# EAGLE schematic board2corrected (EAGLE 6.6.0)

## Sheet 1 of 4
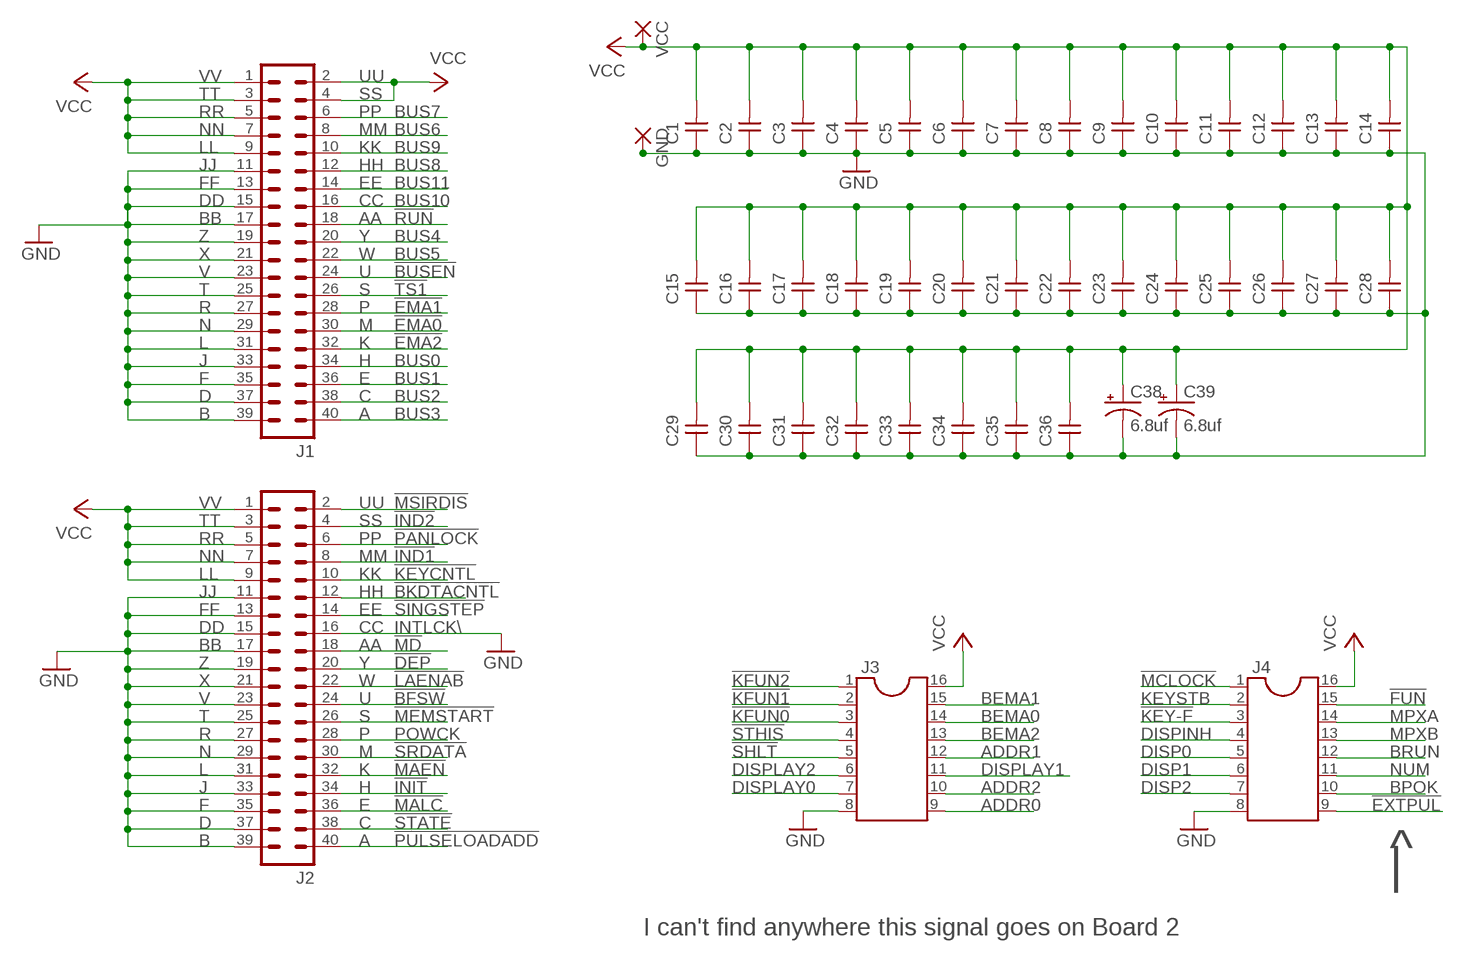
[diagram p0: schematic, sheet 1]

### Parts
C1  CAPNP-5  [C-5]
C2  CAPNP-5  [C-5]
C3  CAPNP-5  [C-5]
C4  CAPNP-5  [C-5]
C5  CAPNP-5  [C-5]
C6  CAPNP-5  [C-5]
C7  CAPNP-5  [C-5]
C8  CAPNP-5  [C-5]
C9  CAPNP-5  [C-5]
C10  CAPNP-5  [C-5]
C11  CAPNP-5  [C-5]
C12  CAPNP-5  [C-5]
C13  CAPNP-5  [C-5]
C14  CAPNP-5  [C-5]
C15  CAPNP-5  [C-5]
C16  CAPNP-5  [C-5]
C17  CAPNP-5  [C-5]
C18  CAPNP-5  [C-5]
C19  CAPNP-5  [C-5]
C20  CAPNP-5  [C-5]
C21  CAPNP-5  [C-5]
C22  CAPNP-5  [C-5]
C23  CAPNP-5  [C-5]
C24  CAPNP-5  [C-5]
C25  CAPNP-5  [C-5]
C26  CAPNP-5  [C-5]
C27  CAPNP-5  [C-5]
C28  CAPNP-5  [C-5]
C29  CAPNP-5  [C-5]
C30  CAPNP-5  [C-5]
C31  CAPNP-5  [C-5]
C32  CAPNP-5  [C-5]
C33  CAPNP-5  [C-5]
C34  CAPNP-5  [C-5]
C35  CAPNP-5  [C-5]
C36  CAPNP-5  [C-5]
C38  6.8uf  CPOL-USE15-5AXIAL  [E15-5]
C39  6.8uf  CPOL-USE15-5AXIAL  [E15-5]
GND  3,81/1,4  [3,81/1,4]
J1  40H  [40H]
J2  40H  [40H]
J3  DIL16S  [SOCKET-16]
J4  DIL16S  [SOCKET-16]
VCC  3,81/1,4  [3,81/1,4]

### Nets
!BFSW: J2.24 ; also sheet 4
!BKDTACNTL: J2.12 ; also sheet 4
!BUSEN: J1.24 ; also sheet 4
!DEP: J2.20 ; also sheet 4
!EMA0: J1.30 ; also sheet 4
!EMA1: J1.28 ; also sheet 4
!EMA2: J1.32 ; also sheet 4
!EXTPUL: J4.9
!FUN: J4.15 ; also sheet 3,4
!IND1: J2.8 ; also sheet 4
!IND2: J2.4 ; also sheet 4
!INIT: J2.34 ; also sheet 4
!KEY-F: J4.3 ; also sheet 4
!KEYCNTL: J2.10 ; also sheet 4
!KFUN0: J3.3 ; also sheet 2,4
!KFUN1: J3.2 ; also sheet 2,4
!KFUN2: J3.1 ; also sheet 2,4
!LAENAB: J2.22 ; also sheet 4
!MAEN: J2.32 ; also sheet 4
!MALC: J2.36 ; also sheet 4
!MCLOCK: J4.1 ; also sheet 3
!MD: J2.18 ; also sheet 4
!MEMSTART: J2.26 ; also sheet 4
!MSIRDIS: J2.2 ; also sheet 4
!PANLOCK: J2.6 ; also sheet 4
!PULSELOADADD: J2.40 ; also sheet 4
!RUN: J1.18 ; also sheet 3
!SHLT: J3.5 ; also sheet 4
!SINGSTEP: J2.14 ; also sheet 4
!SRDATA: J2.30 ; also sheet 3,4
!STATE: J2.38 ; also sheet 4
!STHIS: J3.4 ; also sheet 4
!TS1: J1.26 ; also sheet 3,4
ADDR0: J3.9 ; also sheet 2
ADDR1: J3.12 ; also sheet 2
ADDR2: J3.10 ; also sheet 2
BEMA0: J3.14 ; also sheet 4
BEMA1: J3.15 ; also sheet 4
BEMA2: J3.13 ; also sheet 4
BPOK: J4.10 ; also sheet 2,3,4
BRUN: J4.12 ; also sheet 3,4
BUS0: J1.34 ; also sheet 2
BUS1: J1.36 ; also sheet 2
BUS2: J1.38 ; also sheet 2
BUS3: J1.40 ; also sheet 2
BUS4: J1.20 ; also sheet 2
BUS5: J1.22 ; also sheet 2
BUS6: J1.8 ; also sheet 2
BUS7: J1.6 ; also sheet 2
BUS8: J1.12 ; also sheet 2
BUS9: J1.10 ; also sheet 2
BUS10: J1.16 ; also sheet 2
BUS11: J1.14 ; also sheet 2
DISP0: J4.5 ; also sheet 4
DISP1: J4.6 ; also sheet 4
DISP2: J4.7 ; also sheet 4
DISPINH: J4.4 ; also sheet 3,4
DISPLAY0: J3.7 ; also sheet 2
DISPLAY1: J3.11 ; also sheet 2
DISPLAY2: J3.6 ; also sheet 2
GND [Supply]: C1.1 C2.1 C3.1 C4.1 C5.1 C6.1 C7.1 C8.1 C9.1 C10.1 C11.1 C12.1 C13.1 C14.1 C15.1 C16.1 C17.1 C18.1 C19.1 C20.1 C21.1 C22.1 C23.1 C24.1 C25.1 C26.1 C27.1 C28.1 C29.1 C30.1 C31.1 C32.1 C33.1 C34.1 C35.1 C36.1 C38.- C39.- GND.1(P) J1.11 J1.13 J1.15 J1.17 J1.19 J1.21 J1.23 J1.25 J1.27 J1.29 J1.31 J1.33 J1.35 J1.37 J1.39 J2.11 J2.13 J2.15 J2.16 J2.17 J2.19 J2.21 J2.23 J2.25 J2.27 J2.29 J2.31 J2.33 J2.35 J2.37 J2.39 J3.8 J4.8 ; also sheet 2,3
KEYSTB: J4.2 ; also sheet 3
MPXA: J4.14 ; also sheet 2
MPXB: J4.13 ; also sheet 2
NUM: J4.11 ; also sheet 3
POWCK: J2.28 ; also sheet 4
VCC [Supply]: C1.2 C2.2 C3.2 C4.2 C5.2 C6.2 C7.2 C8.2 C9.2 C10.2 C11.2 C12.2 C13.2 C14.2 C15.2 C16.2 C17.2 C18.2 C19.2 C20.2 C21.2 C22.2 C23.2 C24.2 C25.2 C26.2 C27.2 C28.2 C29.2 C30.2 C31.2 C32.2 C33.2 C34.2 C35.2 C36.2 C38.+ C39.+ J1.1 J1.2 J1.3 J1.4 J1.5 J1.7 J1.9 J2.1 J2.3 J2.5 J2.7 J2.9 J3.16 J4.16 VCC.1(P) ; also sheet 2,3,4

### Notes on the sheet
- VV | UU
- TT | SS
- RR | PP
- NN | MM
- LL | KK
- JJ | HH
- FF | EE
- DD | CC
- BB | AA
- Z | Y
- X | W
- V | U
- T | S
- R | P
- N | M
- L | K
- J | H
- F | E
- D | C
- B | A
- VV | UU
- TT | SS
- RR | PP
- NN | MM
- LL | KK
- JJ | HH
- FF | EE
- DD | CC | INTLCK\\
- BB | AA
- Z | Y
- X | W
- V | U
- T | S
- R | P
- N | M
- L | K
- J | H
- F | E
- D | C
- B | A
- ^
- |
- I can't find anywhere this signal goes on Board 2

## Sheet 2 of 4
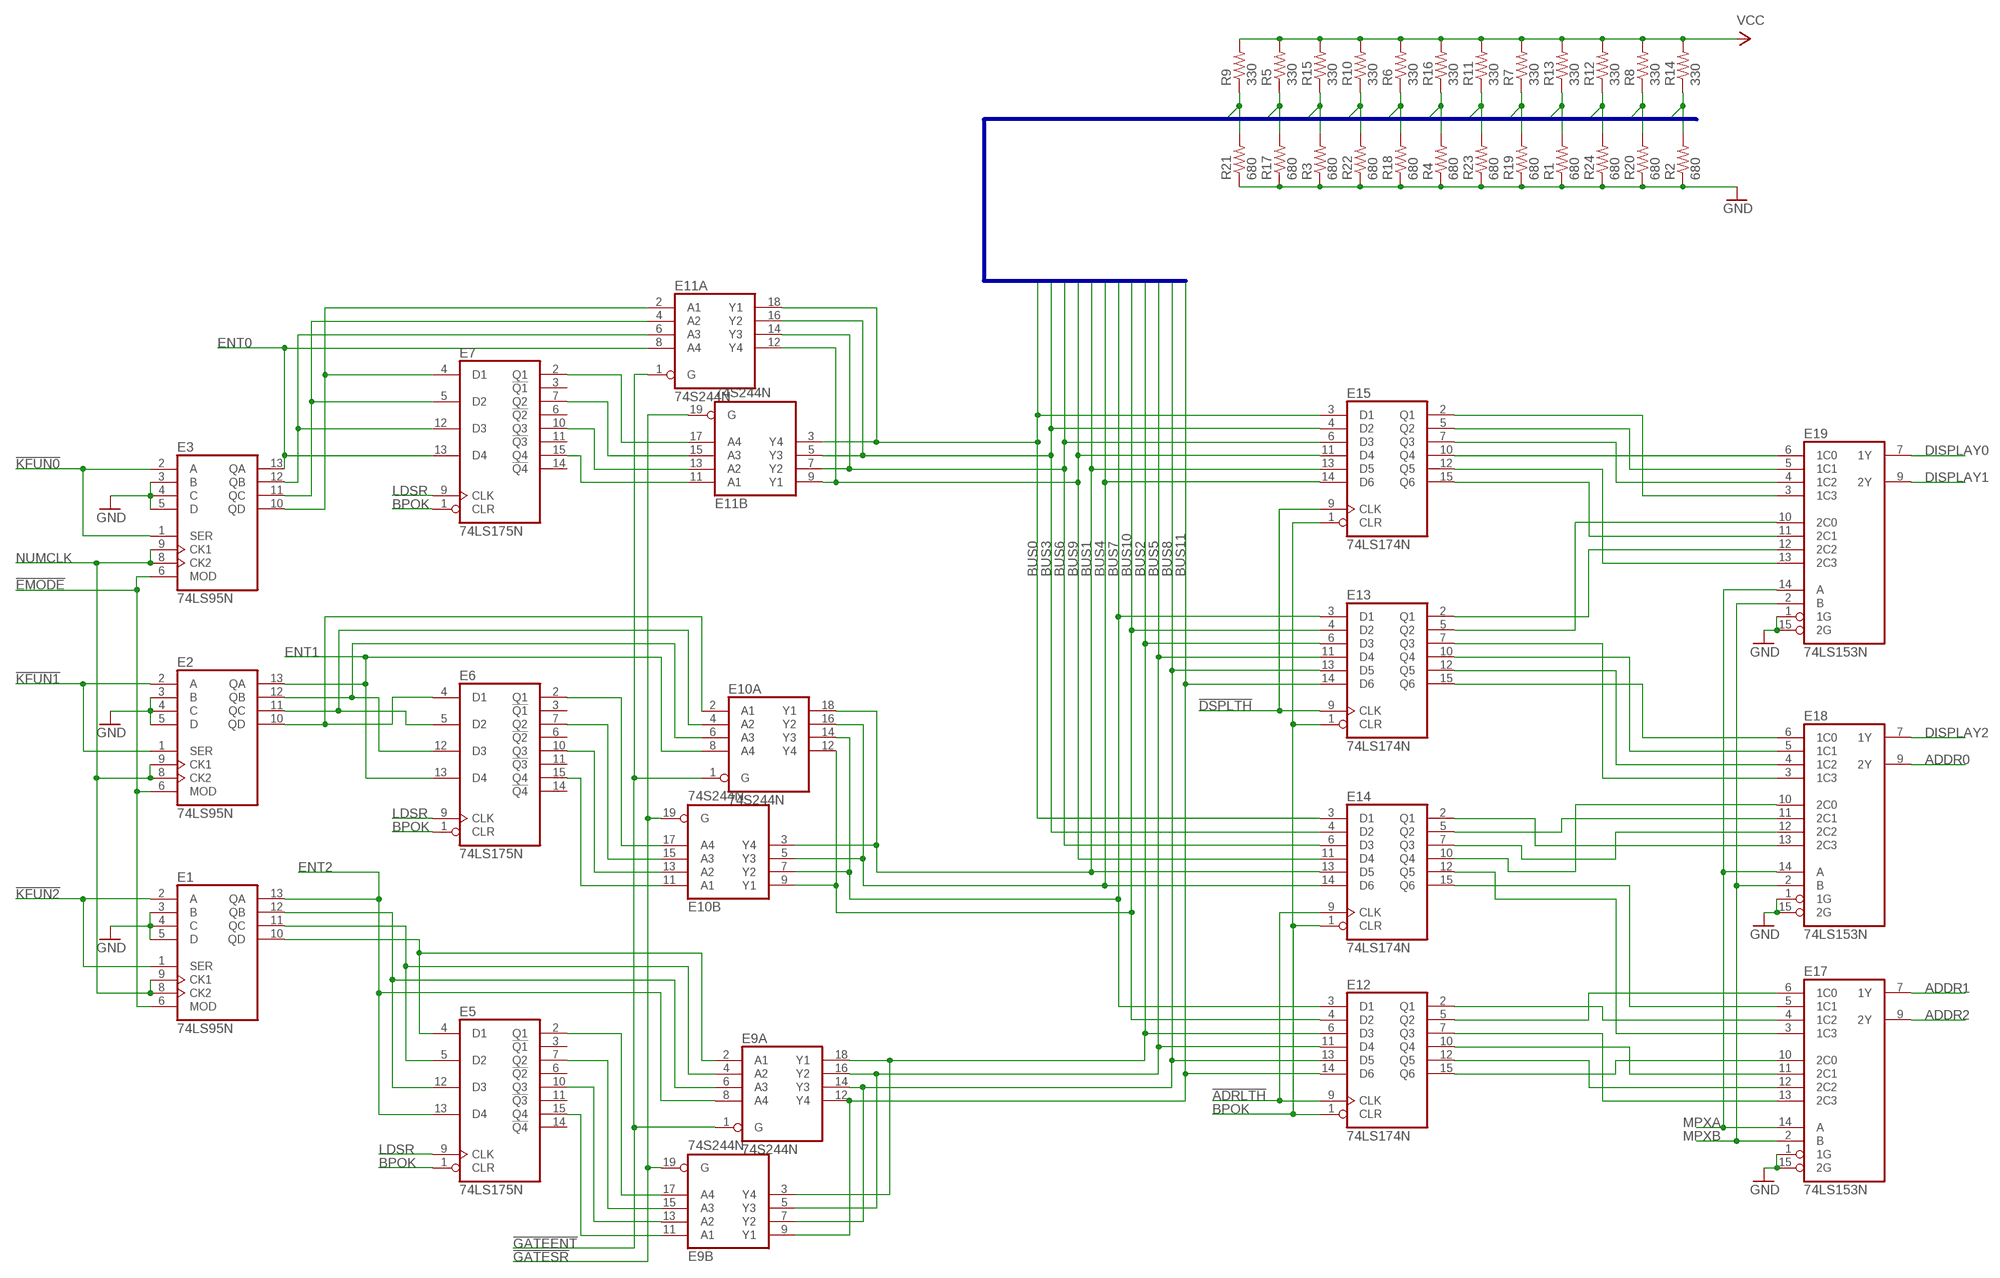
[diagram p1: schematic, sheet 2]

### Parts
E1  74LS95N  [DIL14]
E2  74LS95N  [DIL14]
E3  74LS95N  [DIL14]
E5  74LS175N  [DIL16]
E6  74LS175N  [DIL16]
E7  74LS175N  [DIL16]
E9  74S244N  [DIL20]
E10  74S244N  [DIL20]
E11  74S244N  [DIL20]
E12  74LS174N  [DIL16]
E13  74LS174N  [DIL16]
E14  74LS174N  [DIL16]
E15  74LS174N  [DIL16]
E17  74LS153N  [DIL16]
E18  74LS153N  [DIL16]
E19  74LS153N  [DIL16]
R1  680  R-US_0207/10  [0207/10]
R2  680  R-US_0207/10  [0207/10]
R3  680  R-US_0207/10  [0207/10]
R4  680  R-US_0207/10  [0207/10]
R5  330  R-US_0207/10  [0207/10]
R6  330  R-US_0207/10  [0207/10]
R7  330  R-US_0207/10  [0207/10]
R8  330  R-US_0207/10  [0207/10]
R9  330  R-US_0207/10  [0207/10]
R10  330  R-US_0207/10  [0207/10]
R11  330  R-US_0207/10  [0207/10]
R12  330  R-US_0207/10  [0207/10]
R13  330  R-US_0207/10  [0207/10]
R14  330  R-US_0207/10  [0207/10]
R15  330  R-US_0207/10  [0207/10]
R16  330  R-US_0207/10  [0207/10]
R17  680  R-US_0207/10  [0207/10]
R18  680  R-US_0207/10  [0207/10]
R19  680  R-US_0207/10  [0207/10]
R20  680  R-US_0207/10  [0207/10]
R21  680  R-US_0207/10  [0207/10]
R22  680  R-US_0207/10  [0207/10]
R23  680  R-US_0207/10  [0207/10]
R24  680  R-US_0207/10  [0207/10]

### Nets
!ADRLTH: E12.9(CLK) E14.9(CLK) ; also sheet 3
!DSPLTH: E13.9(CLK) E15.9(CLK) ; also sheet 3
!EMODE: E1.6(MOD) E2.6(MOD) E3.6(MOD) ; also sheet 3
!GATEENT: E9.1(A:G) E10.1(A:G) E11.1(A:G) ; also sheet 3,4
!GATESR: E9.19(B:G) E10.19(B:G) E11.19(B:G) ; also sheet 4
!KFUN0: E3.1(SER) E3.2(A) ; also sheet 1,4
!KFUN1: E2.1(SER) E2.2(A) ; also sheet 1,4
!KFUN2: E1.1(SER) E1.2(A) ; also sheet 1,4
ADDR0: E18.9(2Y) ; also sheet 1
ADDR1: E17.7(1Y) ; also sheet 1
ADDR2: E17.9(2Y) ; also sheet 1
BPOK: E5.1(CLR) E6.1(CLR) E7.1(CLR) E12.1(CLR) E13.1(CLR) E14.1(CLR) E15.1(CLR) ; also sheet 1,3,4
BUS0: E11.3(B:Y4) E11.18(A:Y1) E14.3(D1) E15.3(D1) R9.1 R21.2 ; also sheet 1
BUS1: E10.3(B:Y4) E10.18(A:Y1) E14.13(D5) E15.13(D5) R5.1 R17.2 ; also sheet 1
BUS2: E9.3(B:Y4) E9.18(A:Y1) E12.6(D3) E13.6(D3) R3.2 R15.1 ; also sheet 1
BUS3: E11.5(B:Y3) E11.16(A:Y2) E14.4(D2) E15.4(D2) R10.1 R22.2 ; also sheet 1
BUS4: E10.5(B:Y3) E10.16(A:Y2) E14.14(D6) E15.14(D6) R6.1 R18.2 ; also sheet 1
BUS5: E9.5(B:Y3) E9.16(A:Y2) E12.11(D4) E13.11(D4) R4.2 R16.1 ; also sheet 1
BUS6: E11.7(B:Y2) E11.14(A:Y3) E14.6(D3) E15.6(D3) R11.1 R23.2 ; also sheet 1
BUS7: E10.7(B:Y2) E10.14(A:Y3) E12.3(D1) E13.3(D1) R7.1 R19.2 ; also sheet 1
BUS8: E9.7(B:Y2) E9.14(A:Y3) E12.13(D5) E13.13(D5) R1.2 R12.1 R13.1 R24.2 ; also sheet 1
BUS9: E11.9(B:Y1) E11.12(A:Y4) E14.11(D4) E15.11(D4) ; also sheet 1
BUS10: E10.9(B:Y1) E10.12(A:Y4) E12.4(D2) E13.4(D2) R8.1 R20.2 ; also sheet 1
BUS11: E9.9(B:Y1) E9.12(A:Y4) E12.14(D6) E13.14(D6) R2.2 R14.1 ; also sheet 1
DISPLAY0: E19.7(1Y) ; also sheet 1
DISPLAY1: E19.9(2Y) ; also sheet 1
DISPLAY2: E18.7(1Y) ; also sheet 1
ENT0: E3.13(QA) E7.13(D4) E11.8(A:A4) ; also sheet 4
ENT1: E2.13(QA) E6.13(D4) E10.8(A:A4) ; also sheet 4
ENT2: E1.13(QA) E5.13(D4) E9.8(A:A4) ; also sheet 4
GND [Supply]: E1.3(B) E1.4(C) E1.5(D) E2.3(B) E2.4(C) E2.5(D) E3.3(B) E3.4(C) E3.5(D) E17.1(1G) E17.15(2G) E18.1(1G) E18.15(2G) E19.1(1G) E19.15(2G) R1.1 R2.1 R3.1 R4.1 R17.1 R18.1 R19.1 R20.1 R21.1 R22.1 R23.1 R24.1 ; also sheet 1,3
LDSR: E5.9(CLK) E6.9(CLK) E7.9(CLK) ; also sheet 4
MPXA: E17.14(A) E18.14(A) E19.14(A) ; also sheet 1
MPXB: E17.2(B) E18.2(B) E19.2(B) ; also sheet 1
N$1: E2.12(QB) E6.12(D3) E10.6(A:A3)
N$2: E1.12(QB) E5.12(D3) E9.6(A:A3)
N$3: E1.10(QD) E5.4(D1) E9.2(A:A1)
N$4: E1.11(QC) E5.5(D2) E9.4(A:A2)
N$5: E2.10(QD) E6.4(D1) E10.2(A:A1)
N$6: E2.11(QC) E6.5(D2) E10.4(A:A2)
N$7: E3.12(QB) E7.12(D3) E11.6(A:A3)
N$8: E3.10(QD) E7.4(D1) E11.2(A:A1)
N$9: E3.11(QC) E7.5(D2) E11.4(A:A2)
N$10: E15.2(Q1) E19.3(1C3)
N$11: E15.5(Q2) E19.5(1C1)
N$12: E15.7(Q3) E19.4(1C2)
N$13: E15.10(Q4) E19.6(1C0)
N$14: E15.12(Q5) E19.13(2C3)
N$15: E15.15(Q6) E19.11(2C1)
N$16: E13.2(Q1) E19.12(2C2)
N$17: E13.5(Q2) E19.10(2C0)
N$18: E13.7(Q3) E18.3(1C3)
N$19: E13.10(Q4) E18.5(1C1)
N$20: E13.12(Q5) E18.4(1C2)
N$21: E13.15(Q6) E18.6(1C0)
N$22: E14.2(Q1) E18.13(2C3)
N$23: E14.5(Q2) E18.11(2C1)
N$24: E14.7(Q3) E18.12(2C2)
N$25: E14.10(Q4) E18.10(2C0)
N$26: E12.15(Q6) E17.10(2C0)
N$27: E12.12(Q5) E17.12(2C2)
N$28: E12.10(Q4) E17.11(2C1)
N$29: E12.7(Q3) E17.13(2C3)
N$30: E14.15(Q6) E17.5(1C1)
N$31: E14.12(Q5) E17.3(1C3)
N$32: E12.2(Q1) E17.4(1C2)
N$33: E12.5(Q2) E17.6(1C0)
N$63: E7.15(Q4) E11.11(B:A1)
N$64: E7.10(Q3) E11.13(B:A2)
N$65: E7.7(Q2) E11.15(B:A3)
N$66: E7.2(Q1) E11.17(B:A4)
N$79: E6.15(Q4) E10.11(B:A1)
N$80: E6.10(Q3) E10.13(B:A2)
N$81: E6.7(Q2) E10.15(B:A3)
N$82: E6.2(Q1) E10.17(B:A4)
N$83: E5.15(Q4) E9.11(B:A1)
N$84: E5.10(Q3) E9.13(B:A2)
N$85: E5.2(Q1) E9.17(B:A4)
N$86: E5.7(Q2) E9.15(B:A3)
NUMCLK: E1.8(CK2) E1.9(CK1) E2.8(CK2) E2.9(CK1) E3.8(CK2) E3.9(CK1) ; also sheet 3
VCC [Supply]: R5.2 R6.2 R7.2 R8.2 R9.2 R10.2 R11.2 R12.2 R13.2 R14.2 R15.2 R16.2 ; also sheet 1,3,4
Unconnected: E5.3(!Q1) E5.6(!Q2) E5.11(!Q3) E5.14(!Q4) E6.3(!Q1) E6.6(!Q2) E6.11(!Q3) E6.14(!Q4) E7.3(!Q1) E7.6(!Q2) E7.11(!Q3) E7.14(!Q4)

### Buses
BUS[0..11]

## Sheet 3 of 4
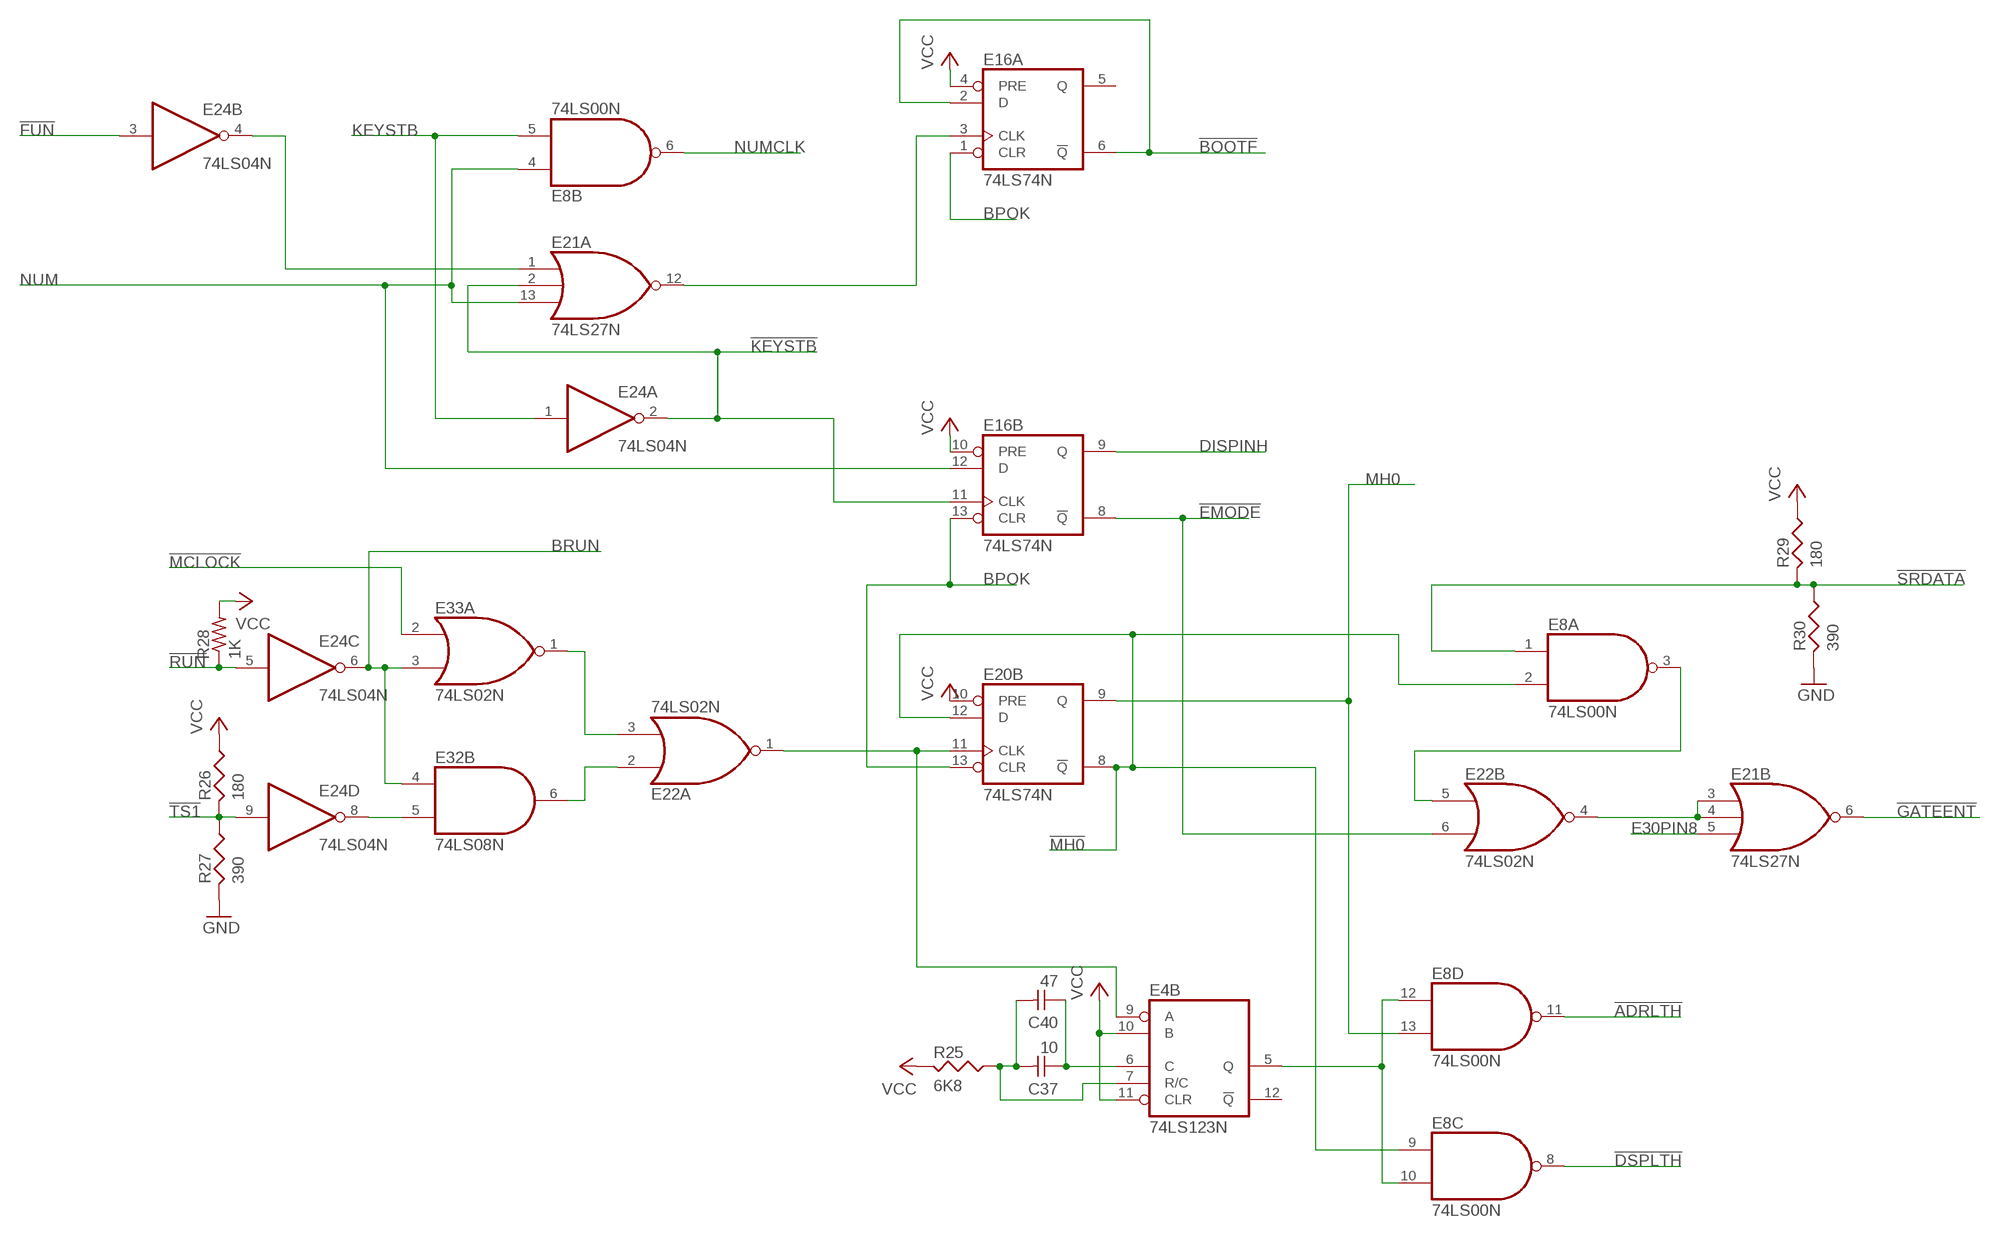
[diagram p2: schematic, sheet 3]

### Parts
C37  10  CAPNP-5  [C-5]
C40  47  CAPNP-5  [C-5]
E4  74LS123N  [DIL16]
E8  74LS00N  [DIL14]
E16  74LS74N  [DIL14]
E20  74LS74N  [DIL14]
E21  74LS27N  [DIL14]
E22  74LS02N  [DIL14]
E24  74LS04N  [DIL14]
E32  74LS08N  [DIL14]
E33  74LS02N  [DIL14]
R25  6K8  RESUS-10  [R-10]
R26  180  RESUS-10  [R-10]
R27  390  RESUS-10  [R-10]
R28  1K  R-US_0207/10  [0207/10]
R29  180  RESUS-10  [R-10]
R30  390  RESUS-10  [R-10]

### Nets
!ADRLTH: E8.11(D:O) ; also sheet 2
!BOOTF: E16.2(A:D) E16.6(A:!Q) ; also sheet 4
!DSPLTH: E8.8(C:O) ; also sheet 2
!EMODE: E16.8(B:!Q) E22.6(B:I1) ; also sheet 2
!FUN: E24.3(B:I) ; also sheet 1,4
!GATEENT: E21.6(B:O) ; also sheet 2,4
!KEYSTB: E16.11(B:CLK) E21.2(A:I1) E24.2(A:O) ; also sheet 4
!MCLOCK: E33.2(A:I0) ; also sheet 1
!MH0: E8.2(A:I1) E8.9(C:I0) E20.8(B:!Q) E20.12(B:D) ; also sheet 4
!RUN: E24.5(C:I) R28.1 ; also sheet 1
!SRDATA: E8.1(A:I0) R29.2 R30.1 ; also sheet 1,4
!TS1: E24.9(D:I) R26.2 R27.1 ; also sheet 1,4
BPOK: E16.1(A:CLR) E16.13(B:CLR) E20.13(B:CLR) ; also sheet 1,2,4
BRUN: E24.6(C:O) E32.4(B:I0) E33.3(A:I1) ; also sheet 1,4
DISPINH: E16.9(B:Q) ; also sheet 1,4
E30PIN8: E21.5(B:I2) ; also sheet 4
GND [Supply]: R27.2 R30.2 ; also sheet 1,2
KEYSTB: E8.5(B:I1) E24.1(A:I) ; also sheet 1
MH0: E8.13(D:I1) E20.9(B:Q) ; also sheet 4
N$34: E16.3(A:CLK) E21.12(A:O)
N$35: E21.1(A:I0) E24.4(B:O)
N$38: E8.3(A:O) E22.5(B:I0)
N$39: E22.3(A:I1) E33.1(A:O)
N$40: E22.2(A:I0) E32.6(B:O)
N$41: E4.9(B:A) E20.11(B:CLK) E22.1(A:O)
N$44: E24.8(D:O) E32.5(B:I1)
N$52: E21.3(B:I0) E21.4(B:I1) E22.4(B:O)
N$75: E4.5(B:Q) E8.10(C:I1) E8.12(D:I0)
N$88: C37.1 C40.1 E4.6(B:C)
N$89: C37.2 C40.2 E4.7(B:R/C) R25.1
NUM: E8.4(B:I0) E16.12(B:D) E21.13(A:I2) ; also sheet 1
NUMCLK: E8.6(B:O) ; also sheet 2
VCC [Supply]: E4.10(B:B) E4.11(B:CLR) E16.4(A:PRE) E16.10(B:PRE) E20.10(B:PRE) R25.2 R26.1 R28.2 R29.1 ; also sheet 1,2,4
Unconnected: E4.1(A:A) E4.2(A:B) E4.3(A:CLR) E4.4(A:!Q) E4.12(B:!Q) E4.13(A:Q) E4.14(A:C) E4.15(A:R/C) E16.5(A:Q)

## Sheet 4 of 4
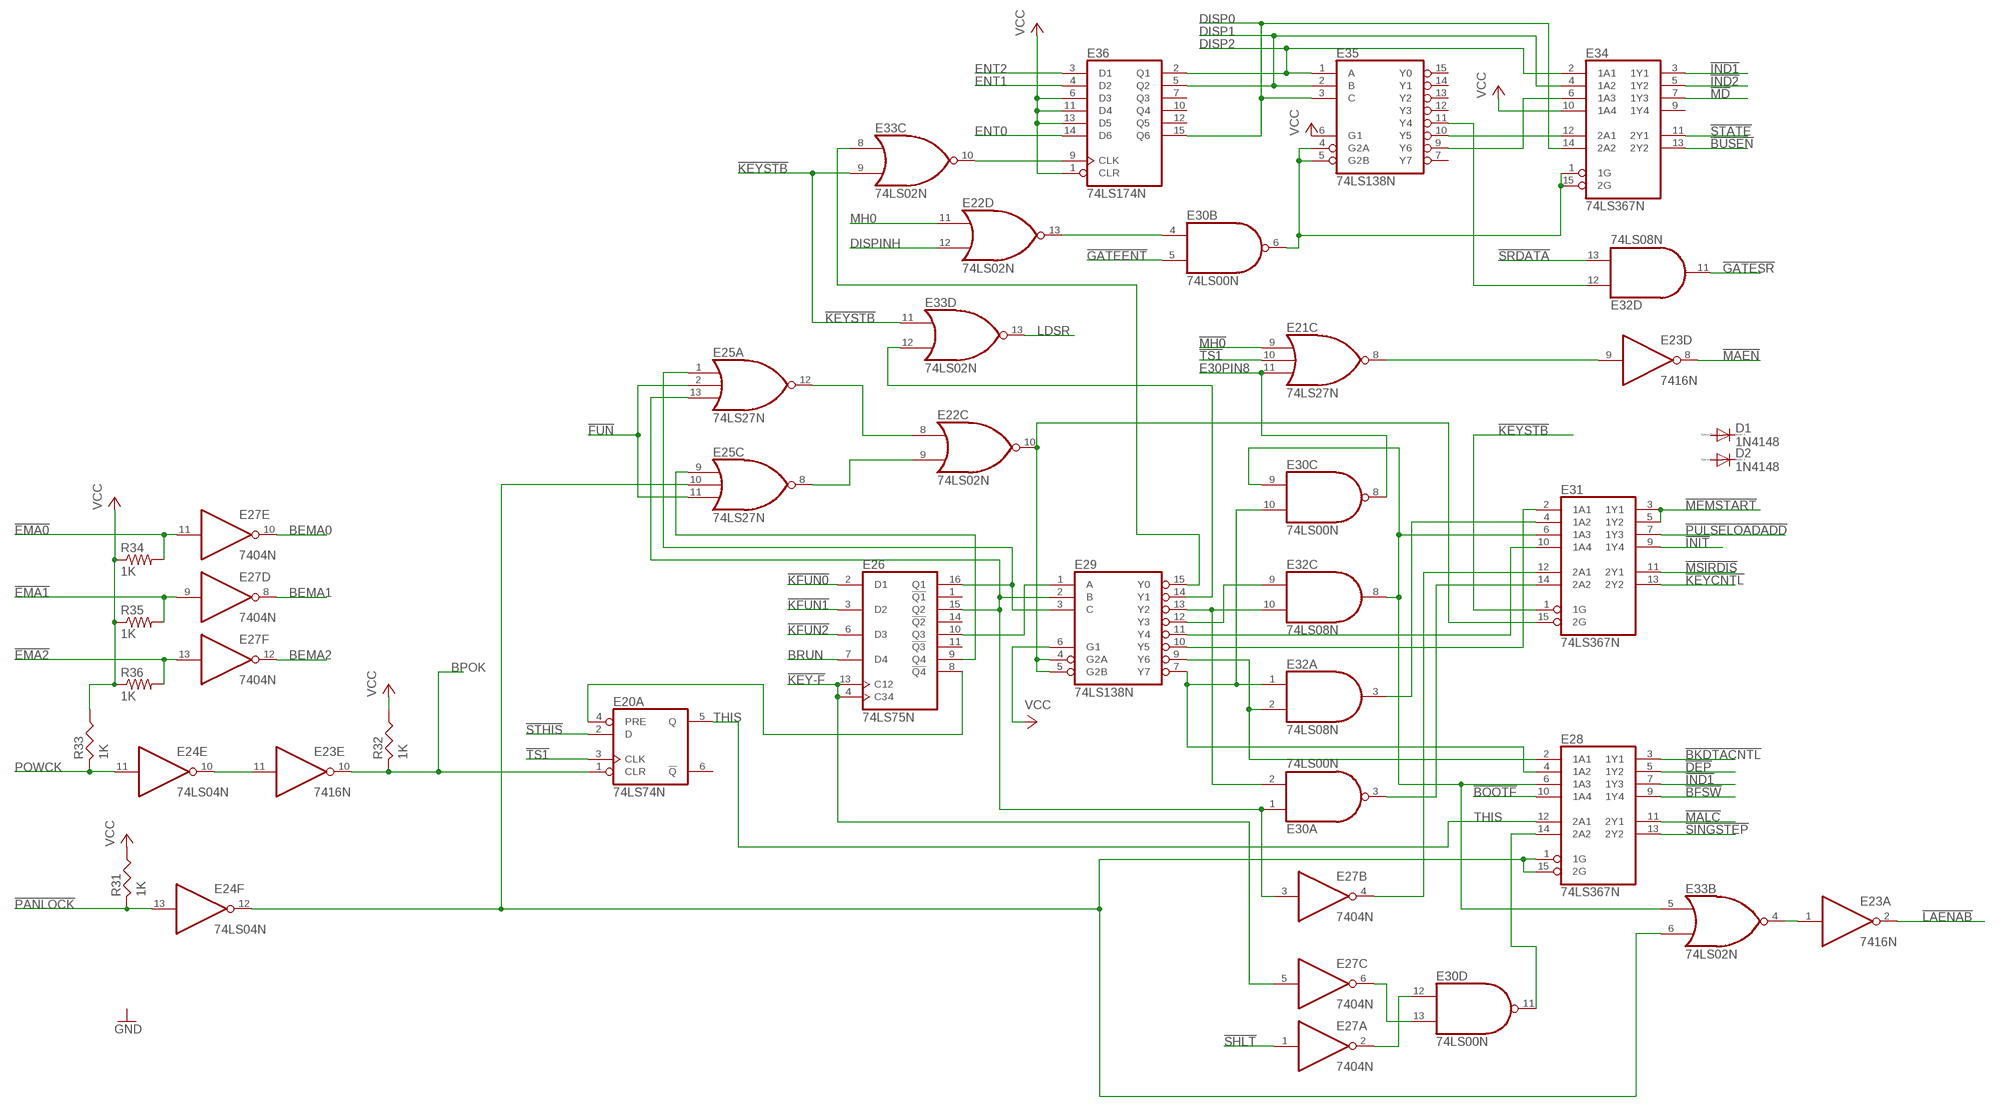
[diagram p3: schematic, sheet 4]

### Parts
D1  1N4148  1N4148DO35-10  [DO35-10]
D2  1N4148  1N4148DO35-10  [DO35-10]
E23  7416N  [DIL14]
E25  74LS27N  [DIL14]
E26  74LS75N  [DIL16]
E27  7404N  [DIL14]
E28  74LS367N  74367N  [DIL16]
E29  74LS138N  [DIL16]
E30  74LS00N  [DIL14]
E31  74LS367N  74367N  [DIL16]
E34  74LS367N  74367N  [DIL16]
E35  74LS138N  [DIL16]
E36  74LS174N  [DIL16]
R31  1K  RESUS-10  [R-10]
R32  1K  RESUS-10  [R-10]
R33  1K  RESUS-10  [R-10]
R34  1K  R-US_0207/10  [0207/10]
R35  1K  R-US_0207/10  [0207/10]
R36  1K  R-US_0207/10  [0207/10]

### Nets
!BFSW: E28.9(1Y4) ; also sheet 1
!BKDTACNTL: E28.3(1Y1) ; also sheet 1
!BOOTF: E28.10(1A4) ; also sheet 3
!BUSEN: E34.13(2Y2) ; also sheet 1
!DEP: E28.5(1Y2) ; also sheet 1
!EMA0: E27.11(E:I) R34.2 ; also sheet 1
!EMA1: E27.9(D:I) R35.2 ; also sheet 1
!EMA2: E27.13(F:I) R36.2 ; also sheet 1
!FUN: E25.2(A:I1) E25.11(C:I2) ; also sheet 1,3
!GATEENT: E30.5(B:I1) ; also sheet 2,3
!GATESR: E32.11(D:O) ; also sheet 2
!IND1: E28.7(1Y3) E34.3(1Y1) ; also sheet 1
!IND2: E34.5(1Y2) ; also sheet 1
!INIT: E31.9(1Y4) ; also sheet 1
!KEY-F: E26.4(C34) E26.13(C12) E27.5(C:I) ; also sheet 1
!KEYCNTL: E31.13(2Y2) ; also sheet 1
!KEYSTB: E31.1(1G) E33.9(C:I1) E33.11(D:I0) ; also sheet 3
!KFUN0: E26.2(D1) ; also sheet 1,2
!KFUN1: E26.3(D2) ; also sheet 1,2
!KFUN2: E26.6(D3) ; also sheet 1,2
!LAENAB: E23.2(A:O) ; also sheet 1
!MAEN: E23.8(D:O) ; also sheet 1
!MALC: E28.11(2Y1) ; also sheet 1
!MD: E34.7(1Y3) ; also sheet 1
!MEMSTART: E31.3(1Y1) E31.5(1Y2) ; also sheet 1
!MH0: E21.9(C:I0) ; also sheet 3
!MSIRDIS: E31.11(2Y1) ; also sheet 1
!PANLOCK: E24.13(F:I) R31.2 ; also sheet 1
!PULSELOADADD: E31.7(1Y3) ; also sheet 1
!SHLT: E27.1(A:I) ; also sheet 1
!SINGSTEP: E28.13(2Y2) ; also sheet 1
!SRDATA: E32.13(D:I1) ; also sheet 1,3
!STATE: E34.11(2Y1) ; also sheet 1
!STHIS: E20.2(A:D) ; also sheet 1
!TS1: E20.3(A:CLK) E21.10(C:I1) ; also sheet 1,3
BEMA0: E27.10(E:O) ; also sheet 1
BEMA1: E27.8(D:O) ; also sheet 1
BEMA2: E27.12(F:O) ; also sheet 1
BPOK: E20.1(A:CLR) E23.10(E:O) R32.2 ; also sheet 1,2,3
BRUN: E26.7(D4) ; also sheet 1,3
DISP0: E34.14(2A2) E35.3(C) E36.15(Q6) ; also sheet 1
DISP1: E34.4(1A2) E35.2(B) E36.5(Q2) ; also sheet 1
DISP2: E34.2(1A1) E35.1(A) E36.2(Q1) ; also sheet 1
DISPINH: E22.12(D:I1) ; also sheet 1,3
E30PIN8: E21.11(C:I2) E30.8(C:O) ; also sheet 3
E35-Y4: E32.12(D:I0) E35.11(Y4)
ENT0: E36.14(D6) ; also sheet 2
ENT1: E36.4(D2) ; also sheet 2
ENT2: E36.3(D1) ; also sheet 2
LDSR: E33.13(D:O) ; also sheet 2
MH0: E22.11(D:I0) ; also sheet 3
N$36: E22.10(C:O) E29.4(G2A) E29.5(G2B) E31.15(2G)
N$37: E22.13(D:O) E30.4(B:I0)
N$42: E22.8(C:I0) E25.12(A:O)
N$46: E33.10(C:O) E36.9(CLK)
N$47: E23.11(E:I) E24.10(E:O)
N$48: E29.15(Y0) E33.8(C:I0)
N$49: E26.10(Q3) E29.1(A)
N$50: E25.13(A:I2) E26.15(Q2) E27.3(B:I) E29.2(B) E30.1(A:I0)
N$51: E25.1(A:I0) E26.16(Q1) E29.3(C)
N$53: E22.9(C:I1) E25.8(C:O)
N$55: E28.4(1A2) E29.7(Y7) E30.10(C:I1) E32.1(A:I0)
N$56: E28.2(1A1) E29.9(Y6) E32.2(A:I1)
N$57: E29.10(Y5) E31.2(1A1)
N$58: E29.11(Y4) E31.10(1A4)
N$59: E29.12(Y3) E32.9(C:I0)
N$60: E29.13(Y2) E30.2(A:I1) E32.10(C:I1)
N$61: E29.14(Y1) E33.12(D:I1)
N$62: E23.1(A:I) E33.4(B:O)
N$67: E27.6(C:O) E30.13(D:I1)
N$68: E28.14(2A2) E30.11(D:O)
N$69: E31.4(1A2) E32.3(A:O)
N$70: E30.6(B:O) E34.1(1G) E34.15(2G) E35.4(G2A) E35.5(G2B)
N$71: E28.6(1A3) E30.9(C:I0) E31.6(1A3) E32.8(C:O) E33.5(B:I0)
N$72: E34.12(2A1) E35.10(Y5)
N$73: E34.6(1A3) E35.9(Y6)
N$74: E27.4(B:O) E31.12(2A1)
N$76: E30.3(A:O) E31.14(2A2)
N$77: E27.2(A:O) E30.12(D:I0)
N$87: E21.8(C:O) E23.9(D:I)
N$93: E20.4(A:PRE) E26.8(!Q4)
N$94: E25.9(C:I0) E26.9(Q4)
PANLOCK: E24.12(F:O) E25.10(C:I1) E28.1(1G) E28.15(2G) E33.6(B:I1)
POWCK: E24.11(E:I) R33.2 ; also sheet 1
THIS: E20.5(A:Q) E28.12(2A1)
VCC [Supply]: E29.6(G1) E34.10(1A4) E35.6(G1) E36.1(CLR) E36.6(D3) E36.11(D4) E36.13(D5) R31.1 R32.1 R33.1 R34.1 R35.1 R36.1 ; also sheet 1,2,3
Unconnected: D1.A D1.C D2.A D2.C E20.6(A:!Q) E23.3(B:I) E23.4(B:O) E23.5(C:I) E23.6(C:O) E23.12(F:O) E23.13(F:I) E25.3(B:I0) E25.4(B:I1) E25.5(B:I2) E25.6(B:O) E26.1(!Q1) E26.11(!Q3) E26.14(!Q2) E34.9(1Y4) E35.7(Y7) E35.12(Y3) E35.13(Y2) E35.14(Y1) E35.15(Y0) E36.7(Q3) E36.10(Q4) E36.12(Q5)

## Power pins joined to a net without a drawn wire
GND: E1.7(GND) E2.7(GND) E3.7(GND) E4.8(P:GND) E5.8(GND) E6.8(GND) E7.8(GND) E8.7(P:GND) E9.10(P:GND) E10.10(P:GND) E11.10(P:GND) E12.8(GND) E13.8(GND) E14.8(GND) E15.8(GND) E16.7(P:GND) E17.8(GND) E18.8(GND) E19.8(GND) E20.7(P:GND) E21.7(P:GND) E22.7(P:GND) E23.7(P:GND) E24.7(P:GND) E25.7(P:GND) E26.12(GND) E27.7(P:GND) E28.8(GND) E29.8(GND) E30.7(P:GND) E31.8(GND) E32.7(P:GND) E33.7(P:GND) E34.8(GND) E35.8(GND) E36.8(GND)
VCC: E1.14(VCC) E2.14(VCC) E3.14(VCC) E4.16(P:VCC) E5.16(VCC) E6.16(VCC) E7.16(VCC) E8.14(P:VCC) E9.20(P:VCC) E10.20(P:VCC) E11.20(P:VCC) E12.16(VCC) E13.16(VCC) E14.16(VCC) E15.16(VCC) E16.14(P:VCC) E17.16(VCC) E18.16(VCC) E19.16(VCC) E20.14(P:VCC) E21.14(P:VCC) E22.14(P:VCC) E23.14(P:VCC) E24.14(P:VCC) E25.14(P:VCC) E26.5(VCC) E27.14(P:VCC) E28.16(VCC) E29.16(VCC) E30.14(P:VCC) E31.16(VCC) E32.14(P:VCC) E33.14(P:VCC) E34.16(VCC) E35.16(VCC) E36.16(VCC)

## Library data of the parts
C1-C37 C40 = discrete:CAPNP-5
C38 C39 = rcl:CPOL-US: POLARIZED CAPACITOR, American symbol
D1 D2 = diode:1N4148: DIODE high speed (Philips)
E1-E3 = 74xx-us:74*95: 4-bit parallel access SHIFT REGISTER
E4 = 74xx-us:74*123: Retriggerable monostable MULTIVIBRATOR
E5-E7 = 74xx-us:74*175: Qadruple D type FLIP FLOP, clear
E8 E30 = 74xx-us:74*00: Quad 2-input NAND gate
E9-E11 = 74xx-us:74*244: Octal BUFFER and LINE DRIVER, 3-state
E12-E15 E36 = 74xx-us:74*174: Hex D type FLIP FLOP, clear
E16 E20 = 74xx-us:74*74: Dual D type positive edge triggered FLIP FLOP, preset and clear
E17-E19 = 74xx-us:74*153: Dual 4-line to 1-line data SELECTOR/MULTIPLEXER
E21 E25 = 74xx-us:74*27: Triple 3-input NOR gate
E22 E33 = 74xx-us:74*02: Quad 2-input NOR gate
E23 = 74xx-us:74*16: Hex INVERTER, open collector, high-voltage
E24 E27 = 74xx-us:74*04: Hex INVERTER
E26 = 74xx-us:74*75: 4-bit bistable LATCH
E28 E31 E34 = 74xx-us:74*367: Hex BUS DRIVER, 3-state
E29 E35 = 74xx-us:74*138: 3-line to 8-line DECODER/DEMULTIPLEXER
E32 = 74xx-us:74*08: Quad 2-input AND gate
GND VCC = wirepad:3,81/1,4: THROUGH-HOLE PAD
J1 J2 = con-harting-h:40H: CONNECTOR; OC_FARNELL: unknown; OC_NEWARK: unknown
J3 J4 = ic-package:DIL16: Dual In Line / Socket
R1-R24 R28 R34-R36 = rcl:R-US_: RESISTOR, American symbol
R25-R27 R29-R33 = discrete:RESUS-10

## Net classes
1 Supply: width 0.508 mm